# EAGLE design HexaWall-v1 (EAGLE 9.6.2)
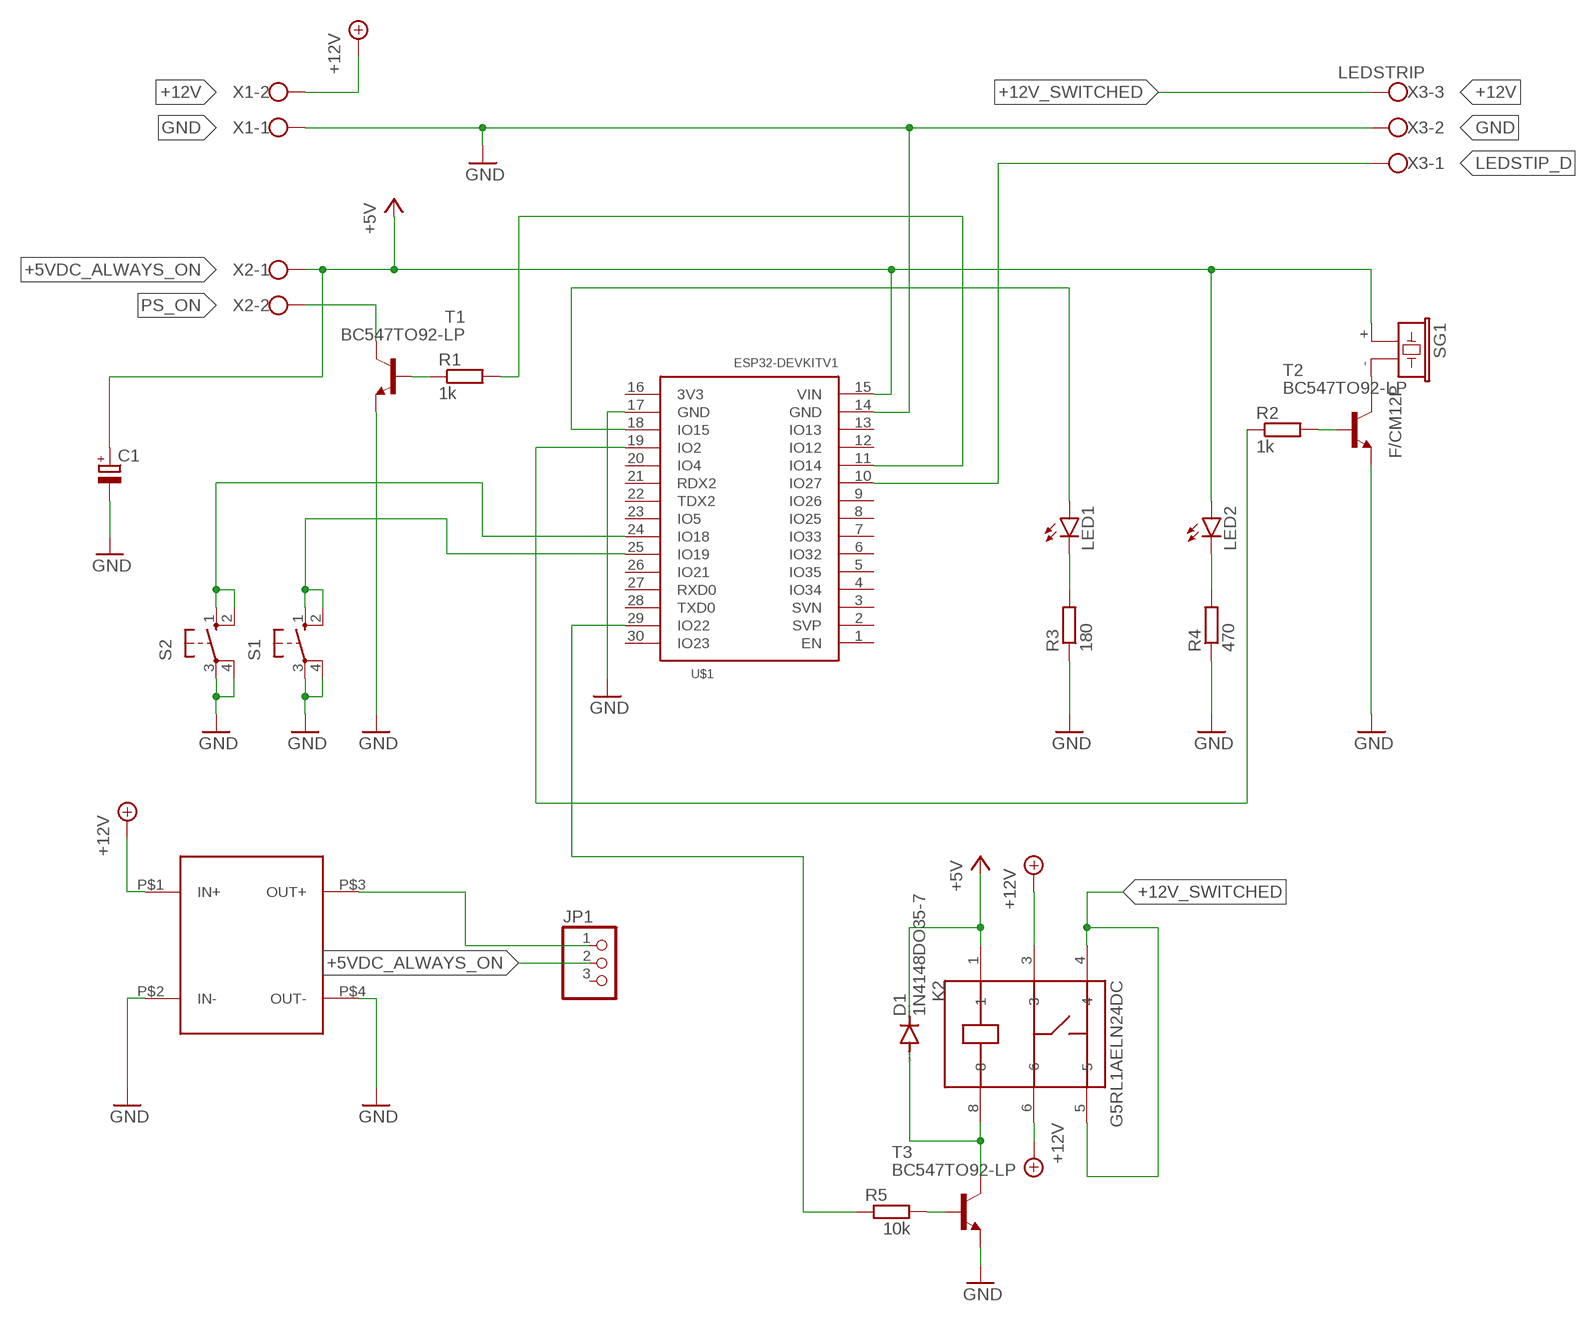
[diagram p0: schematic, sheet 1]

## Parts
C1  CPOL-EUE10-20  [EB20D]
D1  1N4148DO35-7  [DO35-7]
JP1  PINHD-1X3  [1X03]
K2  G5RL1AELN24DC  [G5RL-1-E-HR]
LED1  LED5MM  [LED5MM]
LED2  LED5MM  [LED5MM]
PS$1  DC/DC_PCB  [DC/DC_PCB]
R1  1k  R-EU_0204/7  [0204/7]
R2  1k  R-EU_0204/7  [0204/7]
R3  180  R-EU_0204/7  [0204/7]
R4  470  R-EU_0204/7  [0204/7]
R5  10k  R-EU_0204/7  [0204/7]
S1  40-XX  [B3F-40XX]
S2  40-XX  [B3F-40XX]
SG1  F/CM12P  [F/CM12P]
T1  BC547TO92-LP  [TO92-CBE]
T2  BC547TO92-LP  [TO92-CBE]
T3  BC547TO92-LP  [TO92-CBE]
U$1  ESP32DEVKITV1  [ESP32-DEVKITV1]
X1  W237-102  [W237-102]
X2  W237-102  [W237-102]
X3  LEDSTRIP  W237-103  [W237-103]

## Nets
+5VDC_ALWAYS_ON: C1.+ D1.C JP1.2 K2.1 LED2.A SG1.+ U$1.15(VIN) X2.1 ; supply symbol labelled +5V
+12V: K2.3 K2.6 PS$1.P$1(IN+) X1.2
+12V_SWITCHED: K2.4 K2.5 X3.3
GND: C1.- PS$1.P$2(IN-) PS$1.P$4(OUT-) R3.1 R4.1 S1.3(P) S1.4(P1) S2.3(P) S2.4(P1) T1.E T2.E T3.E U$1.14(GND) U$1.17(GND) X1.1 X3.2
LEDSTIP_D: U$1.10(IO27) X3.1
N$1: R5.2 T3.B
N$2: LED1.K(C) R3.2
N$3: R2.2 T2.B
N$4: R2.1 U$1.19(IO2)
N$5: R1.1 T1.B
N$6: R1.2 U$1.11(IO14)
N$7: LED2.K(C) R4.2
N$8: D1.A K2.8 T3.C
N$9: R5.1 U$1.29(IO22)
N$10: SG1.- T2.C
N$11: LED1.A U$1.18(IO15)
N$12: JP1.1 PS$1.P$3(OUT+)
OTA_BUTTON: S2.1(S) S2.2(S1) U$1.24(IO18)
POWER_BUTTON: S1.1(S) S1.2(S1) U$1.25(IO19)
PS_ON: T1.C X2.2
Unconnected: JP1.3 U$1.1(EN) U$1.2(SVP) U$1.3(SVN) U$1.4(IO34) U$1.5(IO35) U$1.6(IO32) U$1.7(IO33) U$1.8(IO25) U$1.9(IO26) U$1.12(IO12) U$1.13(IO13) U$1.16(3V3) U$1.20(IO4) U$1.21(RDX2) U$1.22(TDX2) U$1.23(IO5) U$1.26(IO21) U$1.27(RXD0) U$1.28(TXD0) U$1.30(IO23)

## Library data of the parts
C1 = rcl:CPOL-EU: POLARIZED CAPACITOR, European symbol; SPICEPREFIX: C
D1 = diode:1N4148: DIODE high speed (Philips); SPICEPREFIX: D
JP1 = pinhead:PINHD-1X3: PIN HEADER
K2 = G5RL1AELN24DC:G5RL1AELN24DC: Electromechanical Relay 24VDC 1.086KOhm 16A SPST-NO (29x12.7x15.7)mm THT Power Relay; SPICEPREFIX: X
LED1 LED2 = nntw.nl:LED: LED OSRAM: - CHIPLED LG R971, LG N971, LY N971, LG Q971, LY Q971, LO R971, LY R971 LH N974, LH R974 LS Q976, LO Q976, LY Q976 LO Q996 - Hyper CHIPLED LW Q18S LB Q993, LB Q99A, LB R99A - SideLED LS A670, LO A670, LY A670, LG A670, LP A670 LB A673, LV A673, LT A673, LW A673 LH A674 LY A675 LS A676, LA A676, LO A676, LY A676, LW A676 LS A679, LY A679, LG A679 - Hyper Micro SIDELED® LS Y876, LA Y876, LO Y876, LY Y876 LT Y87S - SmartLED LW L88C, LW L88S LB L89C, LB L89S, LG L890 LS L89K, LO L89K, LY L89K LS L896, LA L896, LO L896, LY L896 - TOPLED LS T670, LO T670, LY T670, LG T670, LP T670 LSG T670, LSP T670, LSY T670, LOP T670, LYG T670 LG T671, LOG T671, LSG T671 LB T673, LV T673, LT T673, LW T673 LH T674 LS T676, LA T676, LO T676, LY T676, LB T676, LH T676, LSB T676, LW T676 LB T67C, LV T67C, LT T67C, LS T67K, LO T67K, LY T67K, LW E67C LS E67B, LA E67B, LO E67B, LY E67B, LB E67C, LV E67C, LT E67C LW T67C LS T679, LY T679, LG T679 LS T770, LO T770, LY T770, LG T770, LP T770 LB T773, LV T773, LT T773, LW T773 LH T774 LS E675, LA E675, LY E675, LS T675 LS T776, LA T776, LO T776, LY T776, LB T776 LHGB T686 LT T68C, LB T68C - Hyper Mini TOPLED® LB M676 - Mini TOPLED Santana® LG M470 LS M47K, LO M47K, LY M47K Source: http://www.osram.convergy.de LUXEON: - LUMILED® LXK2-PW12-R00, LXK2-PW12-S00, LXK2-PW14-U00, LXK2-PW14-V00 LXK2-PM12-R00, LXK2-PM12-S00, LXK2-PM14-U00 LXK2-PE12-Q00, LXK2-PE12-R00, LXK2-PE12-S00, LXK2-PE14-T00, LXK2-PE14-U00 LXK2-PB12-K00, LXK2-PB12-L00, LXK2-PB12-M00, LXK2-PB14-N00, LXK2-PB14-P00, LXK2-PB14-Q00 LXK2-PR12-L00, LXK2-PR12-M00, LXK2-PR14-Q00, LXK2-PR14-R00 LXK2-PD12-Q00, LXK2-PD12-R00, LXK2-PD12-S00 LXK2-PH12-R00, LXK2-PH12-S00 LXK2-PL12-P00, LXK2-PL12-Q00, LXK2-PL12-R00 Source: www.luxeon.com KINGBRIGHT: KA-3528ASYC Source: www.kingbright.com
PS$1 = nntw.nl:DC/DC_PCB
R1-R5 = nntw.nl:R-EU_: RESISTOR, European symbol; SPICEPREFIX: R
S1 S2 = adafruit:40-XX: OMRON SWITCH; MF: OMRON COMPONENTS USA; MPN: B3F-4000; OC_FARNELL: 176434; OC_NEWARK: 36K3105
SG1 = buzzer:F/CM12P: BUZZER Source: Buerklin; OC_FARNELL: unknown; OC_NEWARK: unknown
T1 T2 = nntw.nl:BC547: NPN TRANSISTOR
T3 = nntw.nl:BC547: NPN TRANSISTOR; SPICEPREFIX: J
U$1 = nntw.nl:ESP32DEVKITV1
X1 X2 = con-wago-500:W237-102: WAGO SCREW CLAMP; MPN: 237-102; OC_FARNELL: unknown; OC_NEWARK: 70K9898
X3 = con-wago-500:W237-103: WAGO SCREW CLAMP; MPN: 237-103; OC_FARNELL: unknown; OC_NEWARK: 18M7116

## Board
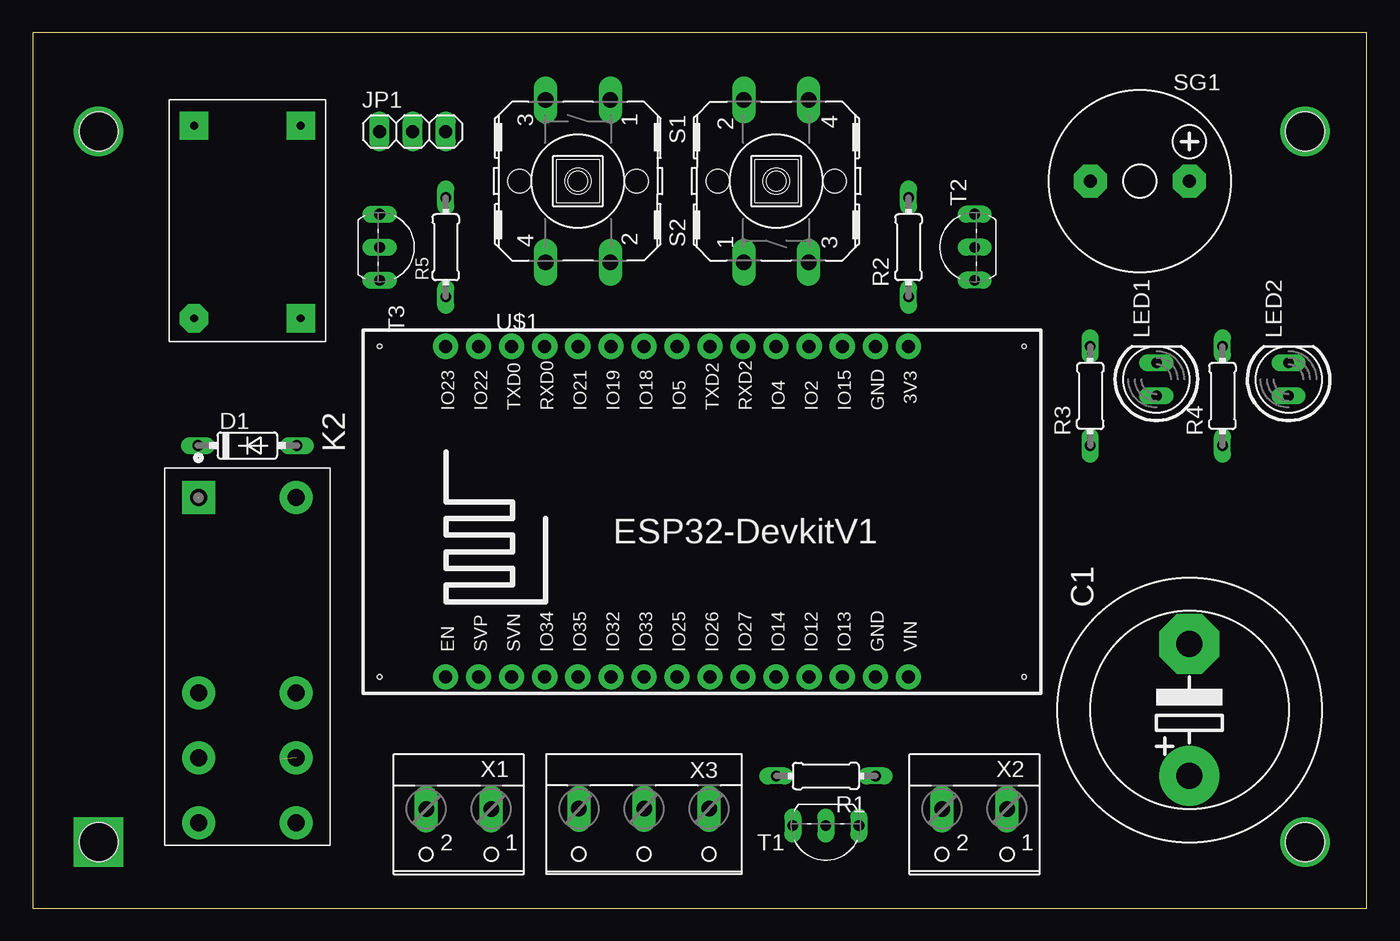
[diagram p1: board, top side]
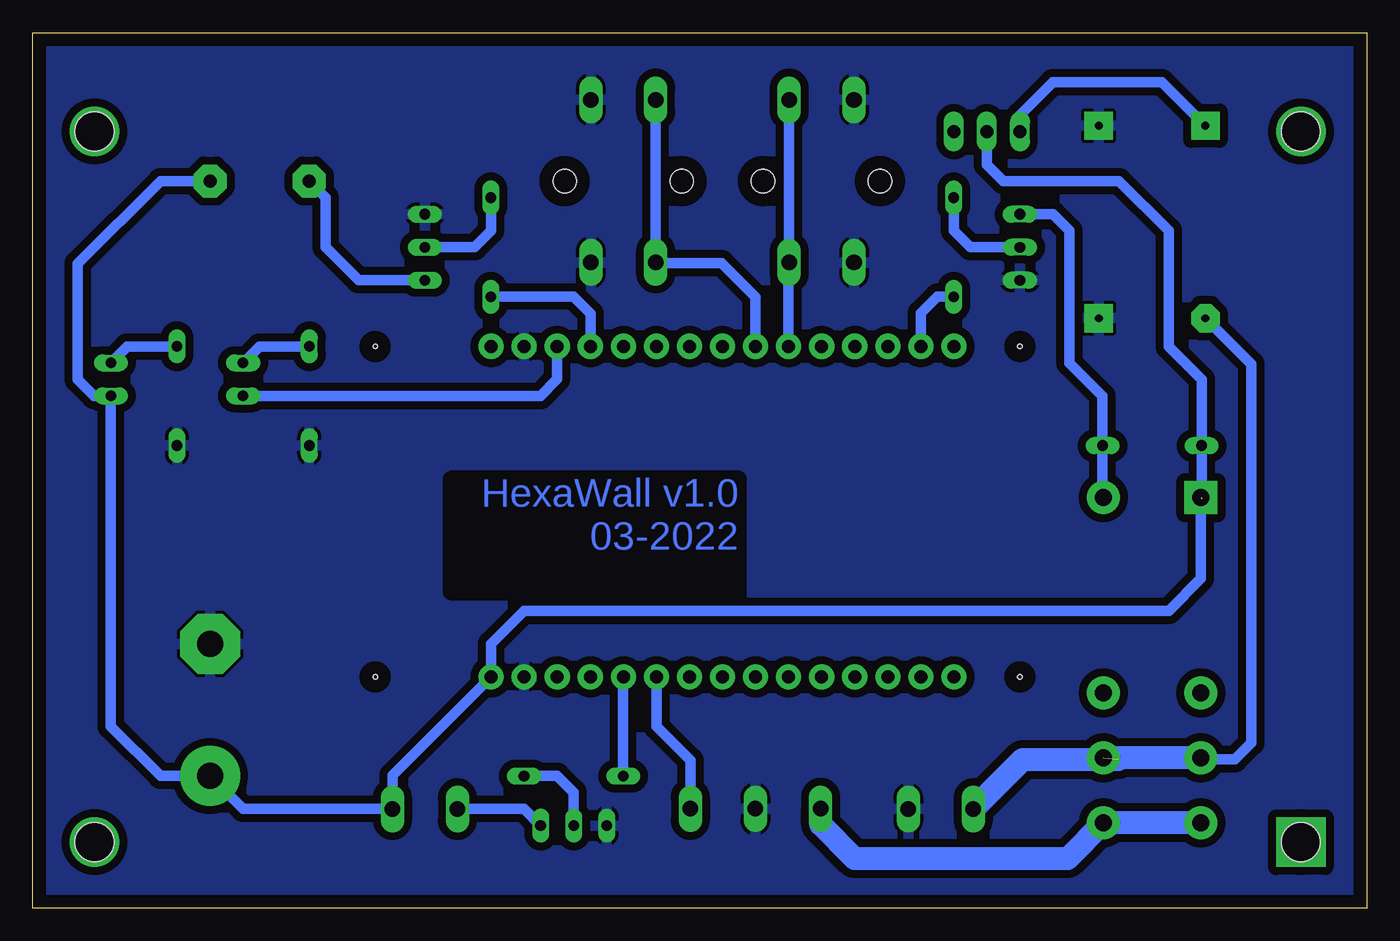
[diagram p2: board, bottom side, seen from below]

Size 102.54 x 67.3 mm. Coordinates in mm from the lower left corner, seen from the top.
Outline: 0,0 102.54,0 102.54,67.3 0,67.3 0,0
Copper layers (1*16): Top 0.035mm / dielectric 1.5mm / Bottom 0.035mm
Design rules "default": minimum track width 6mil, minimum drill 0.35mm, track to track 6mil, track to pad 6mil, pad to pad 6mil, via to via 6mil, smd to smd 6mil, copper to edge 40mil, drill to drill 6mil, minimum pad ring 10mil, minimum via ring 8mil, stop-mask expansion 4mil, vias tented up to drill 0mil, thermal gap 10mil
Holes 3 mm at 5.08,5.08 5.08,59.69 97.79,59.69 97.79,5.08

### Footprints (pad centres in the part's own frame; a part is rotated, then mirrored left to right if it is on the bottom)
EB20D = drill 2.007 pad 4.597: + -5.08,0 | drill 2.007 pad 4.597 octagon: - 5.08,0
DO35-7 = drill 0.813 long: A 3.81,0; C -3.81,0
1X03 = drill 1.016 long: 1 -2.54,0; 2 0,0; 3 2.54,0
G5RL-1-E-HR = drill 1.3 pad 2.54 square: 1 -12.5,-3.75 | drill 1.3 pad 2.54: 2 2.5,-3.75; 3 7.5,-3.75; 4 12.5,-3.75; 5 12.5,3.75; 6 7.5,3.75; 7 2.5,3.75; 8 -12.5,3.75
LED5MM = drill 0.813 long: A -1.27,0; K 1.27,0
DC/DC_PCB = drill 0.6 pad 2.184 octagon: P$1 -8,4.1 | drill 0.6 pad 2.184 square: P$2 -8,-4.1; P$3 6.8,4.1; P$4 6.8,-4.1
0204/7 = drill 0.813 long: 1 -3.81,0; 2 3.81,0
B3F-40XX = drill 1.194 long: 1 -6.248,2.489; 2 6.248,2.489; 3 -6.248,-2.489; 4 6.248,-2.489 | hole 1.803: 0,-4.496; 0,4.496
F/CM12P = drill 1.016 pad 2.54 octagon: + 3.81,0; - -3.81,0
TO92-CBE = drill 0.813 long: B 0,0; C -2.54,0; E 2.54,0
ESP32-DEVKITV1 = drill 1 pad 1.93: 1 -22.87,-11.42; 2 -20.33,-11.42; 3 -17.79,-11.42; 4 -15.25,-11.42; 5 -12.71,-11.42; 6 -10.17,-11.42; 7 -7.63,-11.42; 8 -5.09,-11.42; 9 -2.55,-11.42; 10 -0.01,-11.42; 11 2.53,-11.42; 12 5.07,-11.42; 13 7.61,-11.42; 14 10.15,-11.42; 15 12.69,-11.42; 16 12.69,13.97; 17 10.15,13.97; 18 7.61,13.97; 19 5.07,13.97; 20 2.53,13.97; 21 -0.01,13.97; 22 -2.55,13.97; 23 -5.09,13.97; 24 -7.63,13.97; 25 -10.17,13.97; 26 -12.71,13.97; 27 -15.25,13.97; 28 -17.79,13.97; 29 -20.33,13.97; 30 -22.87,13.97 | hole 0.35: -27.94,13.97; -27.94,-11.43; 21.59,-11.43; 21.59,13.97
W237-102 = drill 1.194 long: 1 -2.5,-1.27; 2 2.5,-1.27
W237-103 = drill 1.194 long: 1 -5,-1.29; 2 0,-1.29; 3 5,-1.29

### Placement (x,y rotation side)
C1  88.9,15.24 90 top
D1  16.51,35.56 0 top
JP1  29.21,59.69 0 top
K2  16.51,19.05 270 top
LED1  86.36,40.64 90 top
LED2  96.52,40.64 90 top
PS$1  16.51,53.34 90 top
R1  60.96,10.16 180 top
R2  67.31,50.8 90 top
R3  81.28,39.37 90 top
R4  91.44,39.37 90 top
R5  31.75,50.8 90 top
S1  41.91,55.88 270 top
S2  57.15,55.88 90 top
SG1  85.09,55.88 0 top
T1  60.96,6.35 180 top
T2  72.39,50.8 90 top
T3  26.67,50.8 270 top
U$1  54.61,29.21 0 top
X1  32.75,6.35 180 top
X2  72.39,6.35 180 top
X3  46.99,6.35 180 top

### Tracks (layer width: path | path; a pad name or v marks a point on that pad's centre or on a via)
+5VDC_ALWAYS_ON  (1 unrouted)
  Bottom 0.813: 12.7,31.49 D1.C 12.7,40.64 15.24,43.18 15.24,52.07 19.05,55.88 27.94,55.88 29.21,57.15 JP1.2 | K2.1 12.76,25.34 15.24,22.86 64.77,22.86 67.3,20.33 U$1.15 74.89,10.2 X2.1 86.36,7.62 C1.+ 92.71,10.16 96.52,13.97 LED2.A 97.79,39.37 99.06,40.64 99.06,49.53 92.71,55.88 SG1.+
+12V  (1 unrouted)
  Bottom 0.813: PS$1.P$1 8.89,41.82 8.89,12.7 10.16,11.43 12.64,11.43 K2.3
  Bottom 1.27: 20.38,11.43 K2.6
  Bottom 1.778: K2.3 K2.6 | X1.2 26.44,11.43 19.11,11.43
+12V_SWITCHED
  Bottom 1.778: X3.3 41.99,6.43 39.37,3.81 23,3.81 K2.5 K2.4
GND
  pour Bottom (isolate 0.61): 0,68.58 102.87,68.58 102.87,0 0,0
LEDSTIP_D
  Bottom 0.813: X3.1 51.99,11.35 54.61,13.97 U$1.10
N$1
  Bottom 0.813: T3.B 30.48,50.8 31.75,52.07 R5.2
N$2
  Bottom 0.813: R3.2 85.09,43.18 LED1.K
N$3
  Bottom 0.813: T2.B 68.58,50.8 67.31,52.07 R2.2
N$4
  Bottom 0.813: R2.1 60.96,46.99 59.68,45.71 U$1.19
N$5
  Bottom 0.813: R1.1 62.23,10.16 60.96,8.89 T1.B
N$6
  Bottom 0.813: R1.2 U$1.11
N$7
  Bottom 0.813: LED2.K 95.25,43.18 R4.2
N$8
  Bottom 0.813: T3.C 24.13,53.34 22.86,52.07 22.86,41.91 20.32,39.37 D1.A 20.32,31.61 K2.8
N$9
  Bottom 0.813: R5.1 33.02,46.99 34.29,45.72 U$1.29
N$10
  Bottom 0.813: T2.C 77.47,48.26 80.01,50.8 80.01,54.61 SG1.-
N$11
  Bottom 0.813: LED1.A 63.5,39.37 62.22,40.65 U$1.18
N$12
  Bottom 0.813: PS$1.P$3 15.77,63.5 24.13,63.5 26.67,60.96 JP1.1
N$13  (via drill 1 pad 3.81)
  other vias: 5.08,5.08
N$14  (via drill 1 pad 3.81)
  other vias: 5.08,59.69
N$15  (via drill 1 pad 3.81)
  other vias: 97.79,59.69
N$16  (via drill 1 pad 3.81)
  other vias: 97.79,5.08
OTA_BUTTON
  Bottom 0.61: 54.66,49.58 S2.1
  Bottom 0.813: S2.1 S2.2 | U$1.24 46.98,46.98 49.58,49.58 54.66,49.58
POWER_BUTTON
  Bottom 0.813: S1.1 S1.2 44.44,49.59 U$1.25
PS_ON
  Bottom 0.813: T1.C 64.77,7.62 X2.2

### Text on the board
Bottom: HexaWall v1.0 / 03-2022